# Altium project soldeerstation.PrjPcb
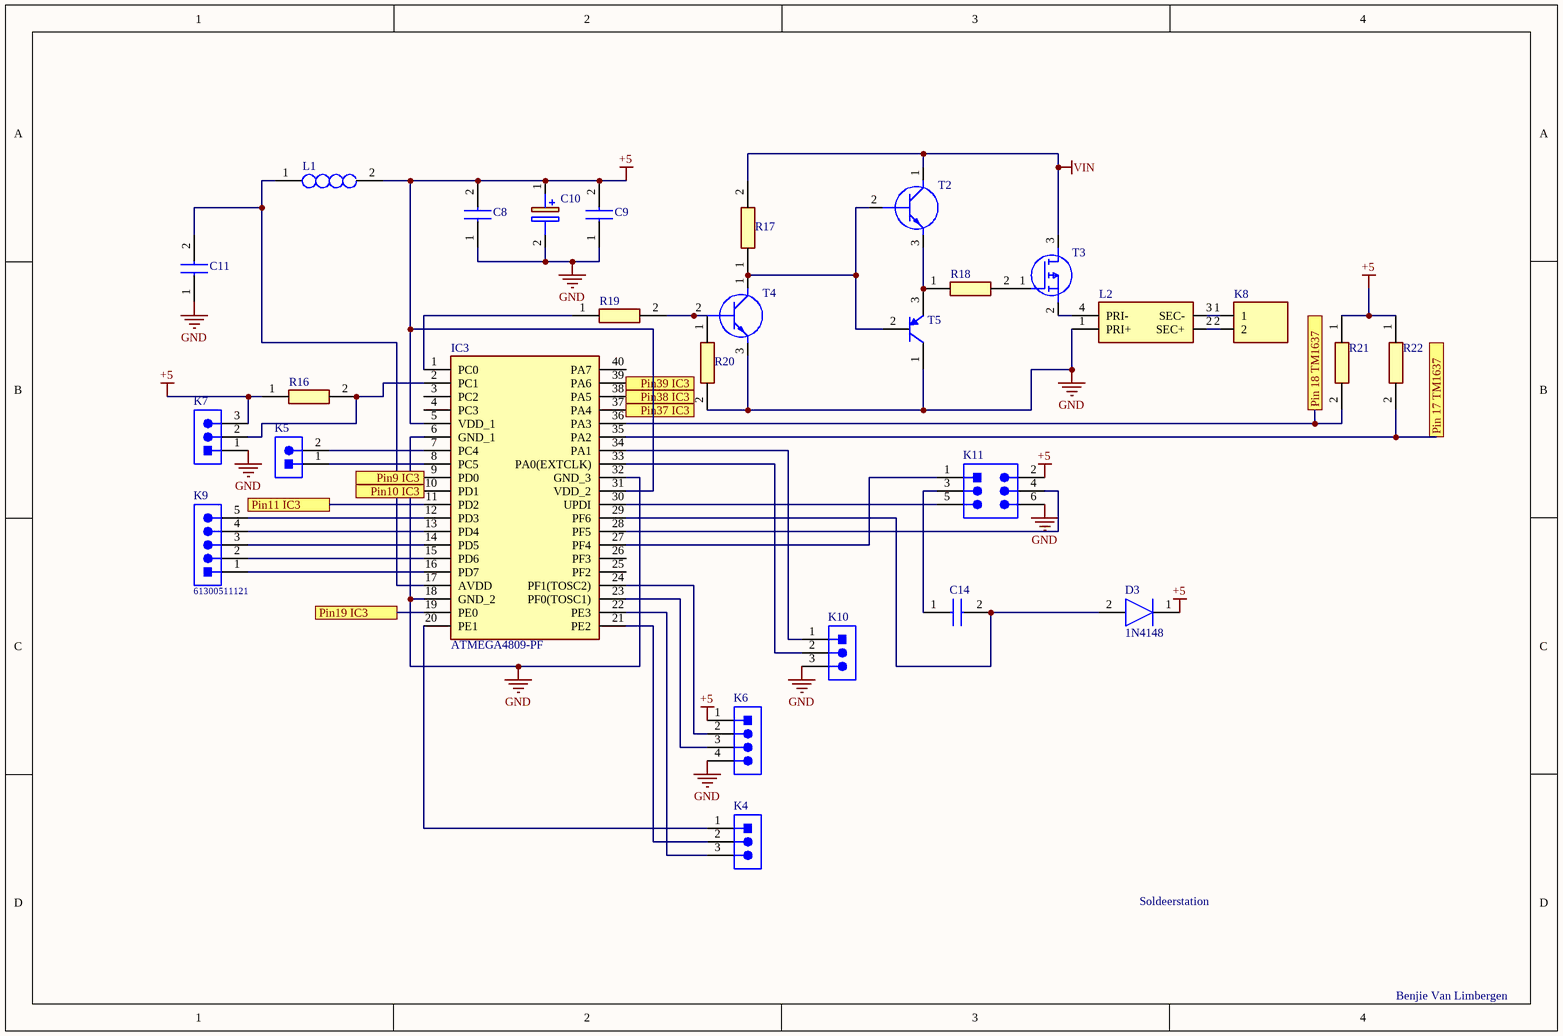
[diagram p0: main.SchDoc]
Title: Soldeerstation
4 sheets, 74 parts. Net scope: flat (ports and power ports of the same name join across sheets).
Board file: PCBv4.PcbDoc
Sheets:
  main.SchDoc
  display.SchDoc
  opamps.SchDoc
  voeding.SchDoc

## Sheet main.SchDoc: Soldeerstation
size A4; DrawnBy: Benjie Van Limbergen; SheetNumber: 1; SheetTotal: 4

### Parts
C8  885012207098  [CAPC2012X90N]  (value not drawn)
C9  885012207098  [CAPC2012X90N]  (value not drawn)
C10  860240672002  [CAPPRD200W52D500H1250]  (value not drawn)
C11  885012207098  [CAPC2012X90N]  (value not drawn)
C14  885012207092  [CAPC2012X90N]  (value not drawn)
D3  1N4148  [DIOAD1165W56L425D185]
IC3  ATMEGA4809-PF  [DIP1543W58P254L5175H635Q40N]
K4  61300311121  [HDR1X3]  (value not drawn)
K5  61300211121  [HDR1X2]  (value not drawn)
K6  61000418221  [HDR1X4]  (value not drawn)
K7  61300311121  [HDR1X3]  (value not drawn)
K8  691214110002  [691214110002]  (value not drawn)
K9  61300511121  [HDR1X5]
K10  61300311121  [HDR1X3]  (value not drawn)
K11  61000621121  [HDR2X3]  (value not drawn)
L1  744711003  [744711003]  (value not drawn)
L2  CM2545X171B-10  [CM2545X171B10]  (value not drawn)
R16  C  [RESC2012X60N]  (value not drawn)
R17  smd  [RESC2012X60N]  (value not drawn)
R18  smd  [RESC2012X60N]  (value not drawn)
R19  smd  [RESC2012X60N]  (value not drawn)
R20  smd  [RESC2012X60N]  (value not drawn)
R21  CRCW08051M00JNEAC  [RESC2012X60N]  (value not drawn)
R22  CRCW08051M00JNEAC  [RESC2012X60N]  (value not drawn)
T2  BC547CBU  [BC547CBU]  (value not drawn)
T3  IRF9Z34NPBF  [TO254P469X1042X1967-3P]  (value not drawn)
T4  BC547CBU  [BC547CBU]  (value not drawn)
T5  BC557CG  [ONSC-TO-92-3-29-11]  (value not drawn)

### Ports
Pin9 IC3, Pin10 IC3, Pin11 IC3, Pin19 IC3, Pin37 IC3, Pin38 IC3, Pin39 IC3, Pin 17 TM1637, Pin 18 TM1637

### Nets
+5: C8.2 C9.2 C10.1(+) D3.1(K) IC3.5(VDD_1) IC3.31(VDD_2) K6.1 K7.3 K11.2 L1.2 R16.1 R21.1 R22.1
GND: C8.1 C9.1 C10.2(-) C11.1 IC3.6(GND_1) IC3.18(GND_2) IC3.32(GND_3) K6.4 K7.1 K10.3 K11.6 L2.1(PRI+) R20.2 T4.3(E) T5.1(C)
VIN: R17.2 T2.1(C) T3.3(D)
NetC6_1: IC3.9(PD0) ; port Pin9 IC3
NetC11_2: C11.2 IC3.17(AVDD) L1.1
NetC12_1: IC3.10(PD1) ; port Pin10 IC3
NetC14_1: C14.1 K11.3
NetC14_2: C14.2 D3.2(A) IC3.29(PF6)
NetD2_1: IC3.11(PD2) ; port Pin11 IC3
NetENC_2: IC3.37(PA4) ; port Pin37 IC3
NetENC_3: IC3.38(PA5) ; port Pin38 IC3
NetENC_5: IC3.39(PA6) ; port Pin39 IC3
NetIC3_1: IC3.1(PC0) R19.1
NetIC3_2: IC3.2(PC1) K7.2 R16.2
NetIC3_7: IC3.7(PC4) K5.2
NetIC3_8: IC3.8(PC5) K5.1
NetIC3_12: IC3.12(PD3) K9.5
NetIC3_13: IC3.13(PD4) K9.4
NetIC3_14: IC3.14(PD5) K9.3
NetIC3_15: IC3.15(PD6) K9.2
NetIC3_16: IC3.16(PD7) K9.1
NetIC3_19: IC3.19(PE0) ; port Pin19 IC3
NetIC3_20: IC3.20(PE1) K4.1
NetIC3_21: IC3.21(PE2) K4.2
NetIC3_22: IC3.22(PE3) K4.3
NetIC3_23: IC3.23(PF0(TOSC1)) K6.3
NetIC3_24: IC3.24(PF1(TOSC2)) K6.2
NetIC3_27: IC3.27(PF4) K11.1
NetIC3_28: IC3.28(PF5) K11.4
NetIC3_30: IC3.30(UPDI) K11.5
NetIC3_33: IC3.33(PA0(EXTCLK)) K10.2
NetIC3_34: IC3.34(PA1) K10.1
NetIC3_35: IC3.35(PA2) R22.2 ; port Pin 17 TM1637
NetIC3_36: IC3.36(PA3) R21.2 ; port Pin 18 TM1637
NetK8_1: K8.1 L2.3(SEC-)
NetK8_2: K8.2 L2.2(SEC+)
NetL2_4: L2.4(PRI-) T3.2(S)
NetR17_1: R17.1 T2.2(B) T4.1(C) T5.2(B)
NetR18_1: R18.1 T2.3(E) T5.3(E)
NetR18_2: R18.2 T3.1(G)
NetR19_2: R19.2 R20.1 T4.2(B)

Not connected (* = marked no-connect by the designer): IC3 3(PC2) 4(PC3) 25(PF2) 26(PF3) 40(PA7)

### Library data of the parts
C8 C9 C11 = 885012207098: Capacitor, C3,C8,C9,C11,C14; Manufacturer_Name: Wurth Elektronik; Datasheet Link: https://componentsearchengine.com//885012207098.pdf; Height: 0.9mm; Mouser2 Part Number: 710-885012207098; Mouser2 Price/Stock: https://www.mouser.com/Search/Refine.aspx?Keyword=710-885012207098; Manufacturer_Part_Number: 885012207098
C10 = 860240672002: Capacitor Polarised c10; Manufacturer_Name: Wurth Elektronik; Datasheet Link: https://katalog.we-online.de/pbs/datasheet/860240672002.pdf; Height: 12.5mm; Manufacturer_Part_Number: 860240672002
C14 = 885012207092: Capacitor c14 100n; Manufacturer_Name: Wurth Elektronik; Datasheet Link: https://katalog.we-online.com/pbs/datasheet/885012207092.pdf; Height: 0.9mm; Manufacturer_Part_Number: 885012207092
D3 = 1N4148: Diode D3; Manufacturer_Name: Nexperia; Datasheet Link: https://datasheet.datasheetarchive.com/originals/distributors/Datasheets-112/DSAP0040891.pdf; Manufacturer_Part_Number: 1N4148
IC3 = ATMEGA4809-PF: Integrated Circuit; Manufacturer_Name: Microchip; Datasheet Link: https://componentsearchengine.com//ATMEGA4809-PF.pdf; Height: 6.35mm; Mouser2 Part Number: 556-ATMEGA4809-PF; Mouser2 Price/Stock: https://www.mouser.com/Search/Refine.aspx?Keyword=556-ATMEGA4809-PF; Manufacturer_Part_Number: ATMEGA4809-PF
K4 K7 = 61300311121: WR-PHD Pin Header, THT, pitch 2.54mm, Single Row, Vertical, 3p; Manufacturer: Wurth Elektronik; Pin Number: 3; Rated Current: 3A; Working Voltage: 250VAC; Withstanding Voltage: 500VAC; Contact Resistance: 20mOhm; ComponentLink1Description: Manufacturer; ComponentLink1URL: http://www.we-online.de; ComponentLink2Description: Datasheet; ComponentLink2URL: https://www.we-online.com/catalog/datasheet/61300311121.pdf; Manufacturer Part Number: 61300311121; Pitch: 2.54mm; Operating Temperature: -40 to +105degC; Mounting Technology: THT; Packaging: Bag; Gender: Pin Header; Row Number: Single; Orientation: Vertical
K5 = 61300211121: WR-PHD Pin Header, THT, pitch 2.54mm, Single Row, Vertical, 2p; Manufacturer: Wurth Elektronik; Pin Number: 2; Rated Current: 3A; Working Voltage: 250VAC; Withstanding Voltage: 500VAC; Contact Resistance: 20mOhm; ComponentLink1Description: Manufacturer; ComponentLink1URL: http://www.we-online.de; ComponentLink2Description: Datasheet; ComponentLink2URL: https://www.we-online.com/catalog/datasheet/61300211121.pdf; Manufacturer Part Number: 61300211121; Pitch: 2.54mm; Operating Temperature: -40 to +105degC; Mounting Technology: THT; Packaging: Bag; Gender: Pin Header; Row Number: Single; Orientation: Vertical
K6 = 61000418221: 4p Header K6; Manufacturer: Wurth Elektronik; Pin Number: 4; Pitch: 2.54mm; Gender: Pin Header; Rated Current: 3A; Working Voltage: 250VAC; Withstanding Voltage: 500VAC; Contact Resistance: 20mOhm; Row Number: Single; ComponentLink1Description: Manufacturer; ComponentLink1URL: http://www.we-online.de; ComponentLink2Description: Datasheet; ComponentLink2URL: https://www.we-online.com/catalog/datasheet/61000418221.pdf; Manufacturer Part Number: 61000418221; Operating Temperature: -40 to +125degC; Mounting Technology: SMT; Packaging: Tube; Orientation: Vertical
K8 = 691214110002: Connector; Manufacturer_Name: Wurth Elektronik; Height: 8.7mm; Manufacturer_Part_Number: 691214110002
K9 = 61300511121: 5P Header k9; Manufacturer: Wurth Elektronik; Pin Number: 5; Pitch: 2.54mm; Gender: Pin Header; Rated Current: 3A; Working Voltage: 250VAC; Withstanding Voltage: 500VAC; Contact Resistance: 20mOhm; Row Number: Single; ComponentLink1Description: Manufacturer; ComponentLink1URL: http://www.we-online.de; ComponentLink2Description: Datasheet; ComponentLink2URL: https://www.we-online.com/catalog/datasheet/61300511121.pdf; Manufacturer Part Number: 61300511121; Operating Temperature: -40 to +105degC; Mounting Technology: THT; Packaging: Bag; Orientation: Vertical
K10 = 61300311121: 3p header K10; Manufacturer: Wurth Elektronik; Pin Number: 3; Pitch: 2.54mm; Gender: Pin Header; Rated Current: 3A; Working Voltage: 250VAC; Withstanding Voltage: 500VAC; Contact Resistance: 20mOhm; Row Number: Single; ComponentLink1Description: Manufacturer; ComponentLink1URL: http://www.we-online.de; ComponentLink2Description: Datasheet; ComponentLink2URL: https://www.we-online.com/catalog/datasheet/61300311121.pdf; Manufacturer Part Number: 61300311121; Operating Temperature: -40 to +105degC; Mounting Technology: THT; Packaging: Bag; Orientation: Vertical
K11 = 61000621121: WR-PHD Pin Header, SMT, pitch 2.54mm, Dual Row, Vertical, 6p; Manufacturer: Wurth Elektronik; Pin Number: 6; Rated Current: 3A; Working Voltage: 250VAC; Withstanding Voltage: 500VAC; Contact Resistance: 20mOhm; ComponentLink1Description: Manufacturer; ComponentLink1URL: http://www.we-online.de; ComponentLink2Description: Datasheet; ComponentLink2URL: https://www.we-online.com/catalog/datasheet/61000621121.pdf; Manufacturer Part Number: 61000621121; Pitch: 2.54mm; Operating Temperature: -40 to +125degC; Mounting Technology: SMT; Packaging: Tube; Gender: Pin Header; Row Number: Dual; Orientation: Vertical
L1 = 744711003: Inductor, Smoorspoel 10uH; Manufacturer_Name: Wurth Elektronik; Datasheet Link: https://www.we-online.de/katalog/datasheet/744711003.pdf; Height: 6.2mm; Manufacturer_Part_Number: 744711003
L2 = CM2545X171B-10: Transformer; Manufacturer_Name: Laird Technologies; Datasheet Link: https://datasheet.datasheetarchive.com/originals/dk/DKDS-7/122753.pdf; Height: 9.5mm; Manufacturer_Part_Number: CM2545X171B-10
R16 R20 = CRCW08051M00JNEAC: Resistor R1-22 / 4k7; Manufacturer_Name: Vishay; Datasheet Link: https://componentsearchengine.com//CRCW08051M00JNEAC.pdf; Height: 0.6mm; Mouser2 Part Number: 71-CRCW08051M00JNEAC; Mouser2 Price/Stock: https://www.mouser.com/Search/Refine.aspx?Keyword=71-CRCW08051M00JNEAC; Manufacturer_Part_Number: CRCW08051M00JNEAC
R17 = CRCW08051M00JNEAC: 4k7; Manufacturer_Name: Vishay; Datasheet Link: https://componentsearchengine.com//CRCW08051M00JNEAC.pdf; Height: 0.6mm; Mouser2 Part Number: 71-CRCW08051M00JNEAC; Mouser2 Price/Stock: https://www.mouser.com/Search/Refine.aspx?Keyword=71-CRCW08051M00JNEAC; Manufacturer_Part_Number: CRCW08051M00JNEAC
R18 = CRCW08051M00JNEAC: 100k; Manufacturer_Name: Vishay; Datasheet Link: https://componentsearchengine.com//CRCW08051M00JNEAC.pdf; Height: 0.6mm; Mouser2 Part Number: 71-CRCW08051M00JNEAC; Mouser2 Price/Stock: https://www.mouser.com/Search/Refine.aspx?Keyword=71-CRCW08051M00JNEAC; Manufacturer_Part_Number: CRCW08051M00JNEAC
R19 = CRCW08051M00JNEAC: 10k; Manufacturer_Name: Vishay; Datasheet Link: https://componentsearchengine.com//CRCW08051M00JNEAC.pdf; Height: 0.6mm; Mouser2 Part Number: 71-CRCW08051M00JNEAC; Mouser2 Price/Stock: https://www.mouser.com/Search/Refine.aspx?Keyword=71-CRCW08051M00JNEAC; Manufacturer_Part_Number: CRCW08051M00JNEAC
R21 R22 = CRCW08051M00JNEAC: Resistor R1-22; Manufacturer_Name: Vishay; Datasheet Link: https://componentsearchengine.com//CRCW08051M00JNEAC.pdf; Height: 0.6mm; Mouser2 Part Number: 71-CRCW08051M00JNEAC; Mouser2 Price/Stock: https://www.mouser.com/Search/Refine.aspx?Keyword=71-CRCW08051M00JNEAC; Manufacturer_Part_Number: CRCW08051M00JNEAC
T2 T4 = BC547CBU: Transistor BJT NPN; Manufacturer_Name: ON Semiconductor; Datasheet Link: https://www.onsemi.com/pdf/datasheet/bc550-d.pdf; Height: 5.33mm; Manufacturer_Part_Number: BC547CBU
T3 = IRF9Z34NPBF: MOSFET (P-Channel); Manufacturer_Name: Infineon; Datasheet Link: https://componentsearchengine.com//IRF9Z34NPBF.pdf; Height: 4.69mm; Mouser2 Part Number: 942-IRF9Z34NPBF; Mouser2 Price/Stock: https://www.mouser.com/Search/Refine.aspx?Keyword=942-IRF9Z34NPBF; Manufacturer_Part_Number: IRF9Z34NPBF
T5 = CMP-1048-01441-1: Amplifier Transistor, PNP Silicon, 3-Pin TO-92, Pb-Free, Bulk Box; Manufacturer: On Semiconductor; IC Continuous (A): -0.1; RoHS: TRUE; DatasheetVersion: Rev. 3; ComponentLink2Description: Datasheet; Packing: Bulk Box; PackageReference: TO-92-3-29-11_AM_SL; ComponentLink3URL: http://www.onsemi.cn/pub_link/Collateral/2N6426-D.PDF; ComponentLink2URL: http://www.onsemi.com/pub_link/Collateral/BC556B-D.PDF; PartNumber: BC557CG; PackageDescription: 3-Pin Transistor Outline, Body 4.825 x 3.685 mm, Pitch 1.27 mm; PackageVersion: Rev. AM; ComponentLink3Description: Package Specification; ComponentLink1URL: http://www.onsemi.com/; ComponentLink1Description: Manufacturer URL; Polarity: PNP; Mounting Technology: Through Hole

## Sheet display.SchDoc: Soldeerstation
size A4; DrawnBy: Benjie Van Limbergen; Revision: 1.0; SheetNumber: 2; SheetTotal: 4
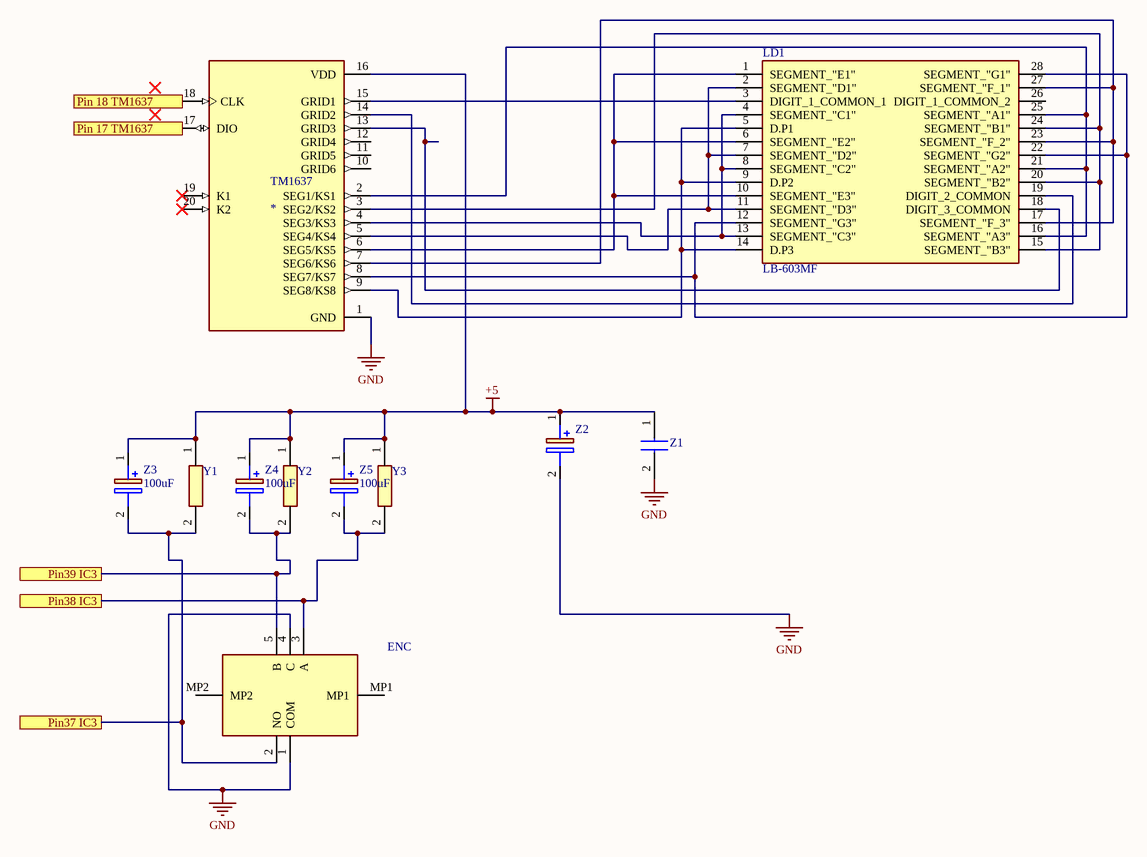
[diagram p1: display.SchDoc]

### Parts
ENC  482016514001  [482016514001]  (value not drawn)
LD1  LB-603MF  [DIP1524W50P254L3750H820Q28N]
TM1637  *  [DIP778W43P254L2612H431Q20N]
Y1  ESR10EZPJ183  [RESC2012X60N]  (value not drawn)
Y2  ESR10EZPJ183  [RESC2012X60N]  (value not drawn)
Y3  ESR10EZPJ183  [RESC2012X60N]  (value not drawn)
Z1  860010683032  [CAPPRD200W55D500H1200]  (value not drawn)
Z2  860240672002  [CAPC2012X90N]  (value not drawn)
Z3  100uF  [CAPC2012X90N]
Z4  100uF  [CAPC2012X90N]
Z5  100uF  [CAPC2012X90N]

### Ports
Pin37 IC3, Pin38 IC3, Pin39 IC3, Pin 17 TM1637, Pin 18 TM1637

### Nets
+5: TM1637.16(VDD) Y1.1 Y2.1 Y3.1 Z1.1(+) Z2.1(+) Z3.1(+) Z4.1(+) Z5.1(+)
GND: ENC.1(COM) ENC.4(C) TM1637.1(GND) Z1.2(-) Z2.2(-)
NetENC_2: ENC.2(NO) Y1.2 Z3.2(-) ; port Pin37 IC3
NetENC_3: ENC.3(A) Y3.2 Z5.2(-) ; port Pin38 IC3
NetENC_5: ENC.5(B) Y2.2 Z4.2(-) ; port Pin39 IC3
NetIC3_35: TM1637.17(DIO) ; port Pin 17 TM1637
NetIC3_36: TM1637.18(CLK) ; port Pin 18 TM1637
NetLD1_1: LD1.1(SEGMENT_"E1") LD1.6(SEGMENT_"E2") LD1.10(SEGMENT_"E3") TM1637.6(SEG5/KS5)
NetLD1_2: LD1.2(SEGMENT_"D1") LD1.7(SEGMENT_"D2") LD1.11(SEGMENT_"D3") TM1637.5(SEG4/KS4)
NetLD1_3: LD1.3(DIGIT_1_COMMON_1) TM1637.15(GRID1)
NetLD1_4: LD1.4(SEGMENT_"C1") LD1.8(SEGMENT_"C2") LD1.13(SEGMENT_"C3") TM1637.4(SEG3/KS3)
NetLD1_5: LD1.5(D.P1) LD1.9(D.P2) LD1.14(D.P3) TM1637.9(SEG8/KS8)
NetLD1_12: LD1.12(SEGMENT_"G3") LD1.22(SEGMENT_"G2") LD1.28(SEGMENT_"G1") TM1637.8(SEG7/KS7)
NetLD1_15: LD1.15(SEGMENT_"B3") LD1.20(SEGMENT_"B2") LD1.24(SEGMENT_"B1") TM1637.3(SEG2/KS2)
NetLD1_16: LD1.16(SEGMENT_"A3") LD1.21(SEGMENT_"A2") LD1.25(SEGMENT_"A1") TM1637.2(SEG1/KS1)
NetLD1_17: LD1.17(SEGMENT_"F_3") LD1.23(SEGMENT_"F_2") LD1.27(SEGMENT_"F_1") TM1637.7(SEG6/KS6)
NetLD1_18: LD1.18(DIGIT_3_COMMON) TM1637.13(GRID3)
NetLD1_19: LD1.19(DIGIT_2_COMMON) TM1637.14(GRID2)

Not connected (* = marked no-connect by the designer): ENC MP1 MP2; LD1 26(DIGIT_1_COMMON_2); TM1637 10(GRID6) 11(GRID5) 12(GRID4) 19(K1)* 20(K2)*

### Library data of the parts
ENC = 482016514001: Switch; Manufacturer_Name: Wurth Elektronik; Datasheet Link: https://componentsearchengine.com//482016514001.pdf; Height: 26.9mm; Mouser2 Part Number: 710-482016514001; Mouser2 Price/Stock: https://www.mouser.com/Search/Refine.aspx?Keyword=710-482016514001; Manufacturer_Part_Number: 482016514001
LD1 = LB-603MF: Display; Manufacturer_Name: ROHM Semiconductor; Datasheet Link: https://datasheet.datasheetarchive.com/originals/distributors/Datasheets_SAMA/27b839e3b28040d1ff79b0bfb62b7eff.pdf; Height: 8.2mm; Manufacturer_Part_Number: LB-603MF
TM1637 = TM1637: LED Drive Control Special Circuit; MF: Titan Micro Electronics; Package: Package; Availability: Not in stock; SnapEDA_Link: https://www.snapeda.com/parts/TM1637/Titan+Micro+Electronics/view-part/?ref=snap; MP: TM1637; Check_prices: https://www.snapeda.com/parts/TM1637/Titan+Micro+Electronics/view-part/?ref=eda; Value: *; Price: None
Y1-Y3 = ESR10EZPJ183: Resistor SMD 0805 10k; Manufacturer_Name: ROHM Semiconductor; Datasheet Link: https://datasheet.datasheetarchive.com/originals/distributors/Datasheets_SAMA/30ccb516c688c96e56c83a00b77a93f4.pdf; Height: 0.65mm; Manufacturer_Part_Number: ESR10EZPJ183
Z1 = 860010683032: Capacitor C1; Manufacturer_Name: Wurth Elektronik; Datasheet Link: https://componentsearchengine.com/Datasheets/2/860010683032.pdf; Height: 41mm; Manufacturer_Part_Number: 860010683032
Z2 = 860240672002: Capacitor Polarised; Manufacturer_Name: Wurth Elektronik; Datasheet Link: https://katalog.we-online.de/pbs/datasheet/860240672002.pdf; Height: 12.5mm; Manufacturer_Part_Number: 860240672002
Z3-Z5 = ECA-1HHG2R2B: Capacitor Polarised C4 3,5mm 8x11mm; Manufacturer_Name: Panasonic; Datasheet Link: http://industrial.panasonic.com/cdbs/www-data/pdf/RDF0000/ABA0000C1215.pdf; Height: 12mm; Manufacturer_Part_Number: ECA-1HHG2R2B

## Sheet opamps.SchDoc: Soldeerstation
size A4; Author: Benjie Van Limbergen; DrawnBy: Benjie Van Limbergen; SheetNumber: 3; SheetTotal: 4
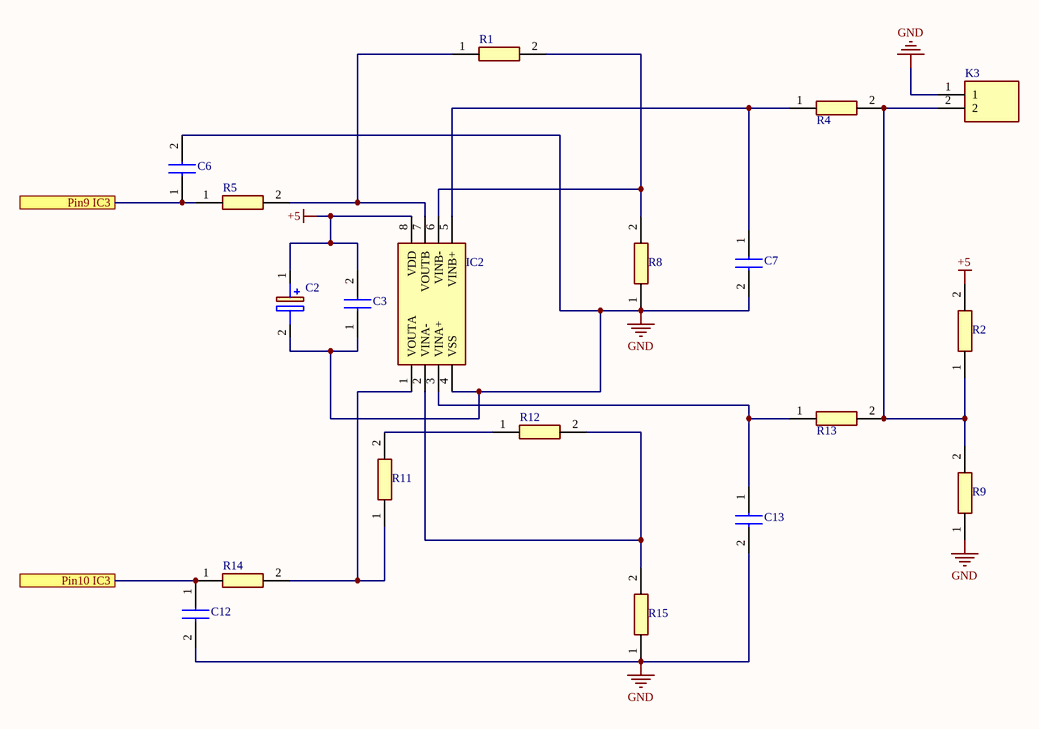
[diagram p2: opamps.SchDoc]

### Parts
C2  860240672002  [CAPPRD200W52D500H1250]  (value not drawn)
C3  885012207098  [CAPC2012X90N]  (value not drawn)
C6  885012205067  [CAPC2012X90N]  (value not drawn)
C7  885012205067  [CAPC2012X90N]  (value not drawn)
C12  885012205067  [CAPC2012X90N]  (value not drawn)
C13  885012205067  [CAPC2012X90N]  (value not drawn)
IC2  MCP6002-E_P  [DIP781W56P254L950H533Q8N]  (value not drawn)
K3  691214110002  [691214110002]  (value not drawn)
R1  smd  [RESC2012X60N]  (value not drawn)
R2  smd  [RESC2012X60N]  (value not drawn)
R4  smd  [RESC2012X60N]  (value not drawn)
R5  smd  [RESC2012X60N]  (value not drawn)
R8  smd  [RESC2012X60N]  (value not drawn)
R9  smd  [RESC2012X60N]  (value not drawn)
R11  smd  [RESC2012X60N]  (value not drawn)
R12  smd  [RESC2012X60N]  (value not drawn)
R13  smd  [RESC2012X60N]  (value not drawn)
R14  smd  [RESC2012X60N]  (value not drawn)
R15  smd  [RESC2012X60N]  (value not drawn)

### Ports
Pin9 IC3, Pin10 IC3

### Nets
+5: C2.1(+) C3.2 IC2.8(VDD) R2.2
GND: C2.2(-) C3.1 C6.2 C7.2 C12.2 C13.2 IC2.4(VSS) K3.1 R8.1 R9.1 R15.1
NetC6_1: C6.1 R5.1 ; port Pin9 IC3
NetC7_1: C7.1 IC2.5(VINB+) R4.1
NetC12_1: C12.1 R14.1 ; port Pin10 IC3
NetC13_1: C13.1 IC2.3(VINA+) R13.1
NetIC2_1: IC2.1(VOUTA) R11.1 R14.2
NetIC2_2: IC2.2(VINA-) R12.2 R15.2
NetIC2_6: IC2.6(VINB-) R1.2 R8.2
NetIC2_7: IC2.7(VOUTB) R1.1 R5.2
NetK3_2: K3.2 R2.1 R4.2 R9.2 R13.2
NetR11_2: R11.2 R12.1

### Library data of the parts
C2 = 860240672002: Capacitor Polarised 10uf 50v stee 2mm 5x11mm; Manufacturer_Name: Wurth Elektronik; Datasheet Link: https://katalog.we-online.de/pbs/datasheet/860240672002.pdf; Height: 12.5mm; Manufacturer_Part_Number: 860240672002
C3 = 885012207098: Capacitor, C3,C8,C9,C11,C14 100nf; Manufacturer_Name: Wurth Elektronik; Datasheet Link: https://componentsearchengine.com//885012207098.pdf; Height: 0.9mm; Mouser2 Part Number: 710-885012207098; Mouser2 Price/Stock: https://www.mouser.com/Search/Refine.aspx?Keyword=710-885012207098; Manufacturer_Part_Number: 885012207098
C6 C7 C12 C13 = 885012205067: Capacitor C6, C7, C12,C13; Manufacturer_Name: Wurth Elektronik; Datasheet Link: https://katalog.we-online.com/pbs/datasheet/885012205067.pdf; Height: 0.55mm; Manufacturer_Part_Number: 885012205067
IC2 = MCP6002-E_P: IC Dual Opamp; Manufacturer_Name: Microchip; Manufacturer_Part_Number: MCP6002-E/P; Datasheet Link: https://componentsearchengine.com//MCP6002-E_P.pdf; Height: 5.334mm; Mouser2 Part Number: 579-MCP6002-E/P; Mouser2 Price/Stock: https://www.mouser.com/Search/Refine.aspx?Keyword=579-MCP6002-E%2FP
K3 = 691214110002: Connector K3; Manufacturer_Name: Wurth Elektronik; Height: 8.7mm; Manufacturer_Part_Number: 691214110002
R1 R4 R5 R8 = CRCW08051M00JNEAC: 100k; Manufacturer_Name: Vishay; Datasheet Link: https://componentsearchengine.com//CRCW08051M00JNEAC.pdf; Height: 0.6mm; Mouser2 Part Number: 71-CRCW08051M00JNEAC; Mouser2 Price/Stock: https://www.mouser.com/Search/Refine.aspx?Keyword=71-CRCW08051M00JNEAC; Manufacturer_Part_Number: CRCW08051M00JNEAC
R2 = CRCW08051M00JNEAC: 1m; Manufacturer_Name: Vishay; Datasheet Link: https://componentsearchengine.com//CRCW08051M00JNEAC.pdf; Height: 0.6mm; Mouser2 Part Number: 71-CRCW08051M00JNEAC; Mouser2 Price/Stock: https://www.mouser.com/Search/Refine.aspx?Keyword=71-CRCW08051M00JNEAC; Manufacturer_Part_Number: CRCW08051M00JNEAC
R9 = CRCW08051M00JNEAC: 10m; Manufacturer_Name: Vishay; Datasheet Link: https://componentsearchengine.com//CRCW08051M00JNEAC.pdf; Height: 0.6mm; Mouser2 Part Number: 71-CRCW08051M00JNEAC; Mouser2 Price/Stock: https://www.mouser.com/Search/Refine.aspx?Keyword=71-CRCW08051M00JNEAC; Manufacturer_Part_Number: CRCW08051M00JNEAC
R11 R12 = CRCW08051M00JNEAC: 18k; Manufacturer_Name: Vishay; Datasheet Link: https://componentsearchengine.com//CRCW08051M00JNEAC.pdf; Height: 0.6mm; Mouser2 Part Number: 71-CRCW08051M00JNEAC; Mouser2 Price/Stock: https://www.mouser.com/Search/Refine.aspx?Keyword=71-CRCW08051M00JNEAC; Manufacturer_Part_Number: CRCW08051M00JNEAC
R13 R14 = CRCW08051M00JNEAC: 5k6; Manufacturer_Name: Vishay; Datasheet Link: https://componentsearchengine.com//CRCW08051M00JNEAC.pdf; Height: 0.6mm; Mouser2 Part Number: 71-CRCW08051M00JNEAC; Mouser2 Price/Stock: https://www.mouser.com/Search/Refine.aspx?Keyword=71-CRCW08051M00JNEAC; Manufacturer_Part_Number: CRCW08051M00JNEAC
R15 = CRCW08051M00JNEAC: 100ohm; Manufacturer_Name: Vishay; Datasheet Link: https://componentsearchengine.com//CRCW08051M00JNEAC.pdf; Height: 0.6mm; Mouser2 Part Number: 71-CRCW08051M00JNEAC; Mouser2 Price/Stock: https://www.mouser.com/Search/Refine.aspx?Keyword=71-CRCW08051M00JNEAC; Manufacturer_Part_Number: CRCW08051M00JNEAC

## Sheet voeding.SchDoc: Voeding
size A4; Date: 18/03/2022; Engineer: Benjie Van Limbergen; Revision: 1.0; SheetNumber: 4; SheetTotal: 4
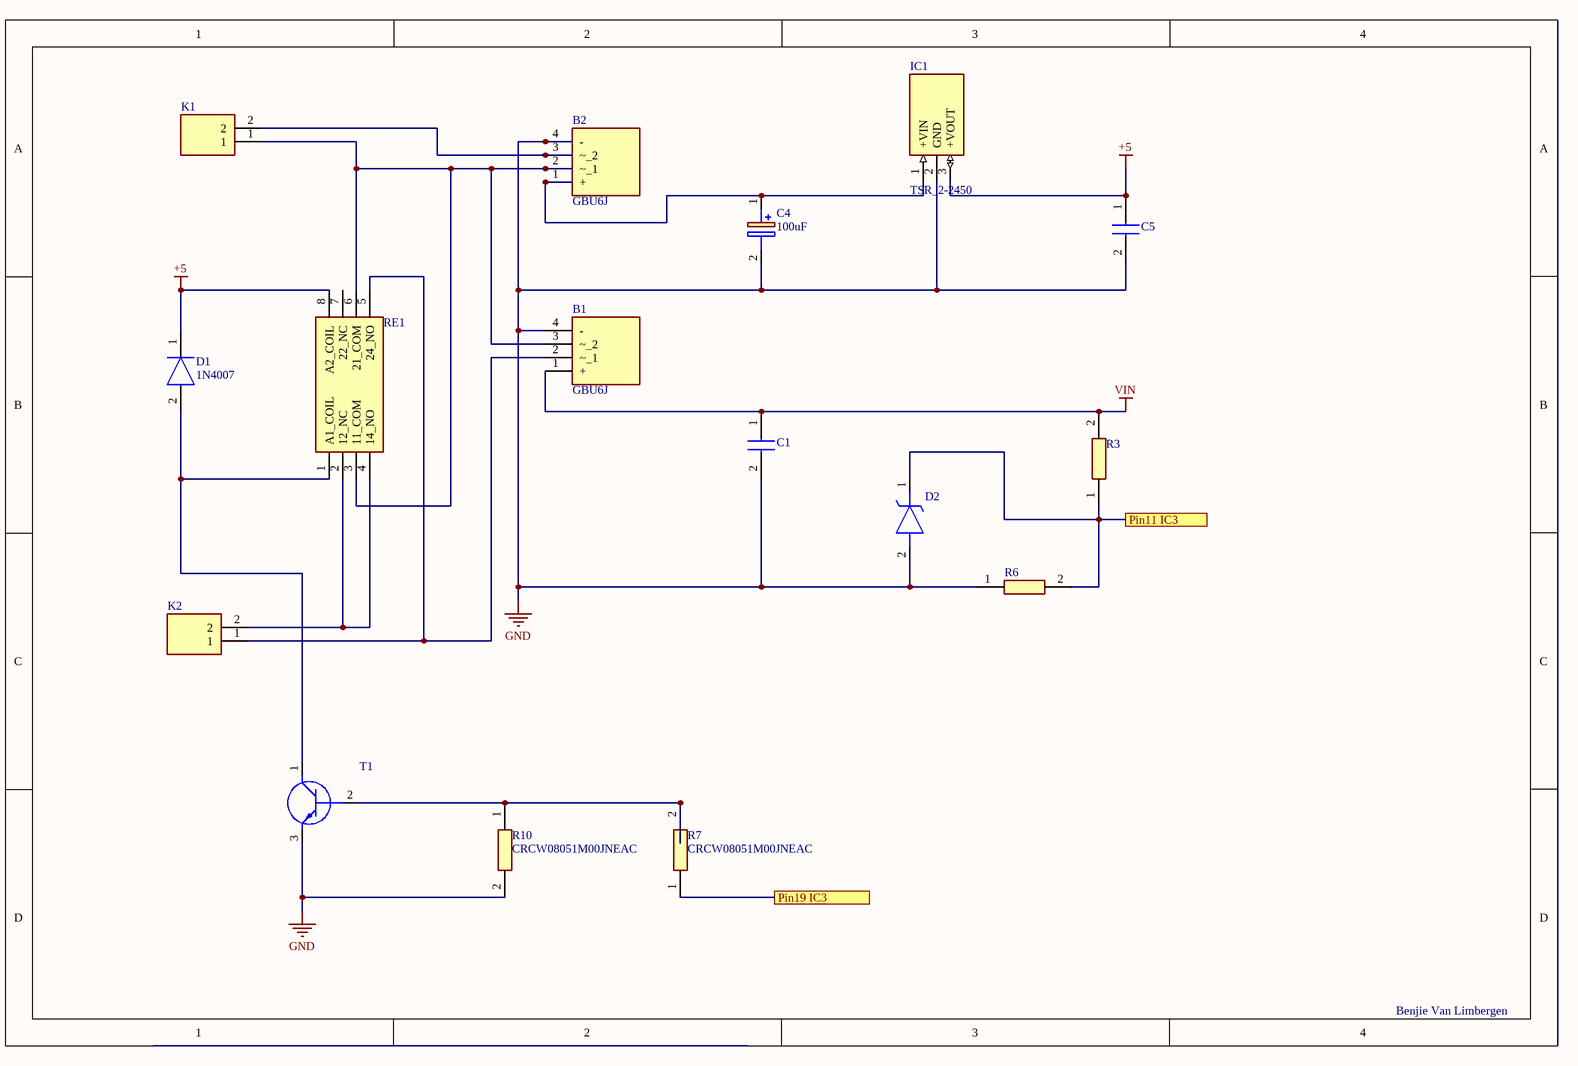
[diagram p3: voeding.SchDoc]

### Parts
B1  GBU6J  [GBU6J]
B2  GBU6J  [GBU6J]
C1  860010683032  [CAPPRD1000W80D2200H4100]  (value not drawn)
C4  100uF  [CAPPRD200W55D500H1200]
C5  860010683032  [CAPPRD200W52D500H1250]  (value not drawn)
D1  1N4007  [DIOAD1410W86L470D235]
D2  1N5231BTR  [DIOAD1068W53L380D172]  (value not drawn)
IC1  TSR_2-2450  [TSR-2]
K1  691214110002  [691214110002]  (value not drawn)
K2  691214110002  [691214110002]  (value not drawn)
R3  CRCW08051M00JNEAC  [RESC2012X60N]  (value not drawn)
R6  CRCW08051M00JNEAC  [RESC2012X60N]  (value not drawn)
R7  CRCW08051M00JNEAC  [RESC2012X60N]
R10  CRCW08051M00JNEAC  [RESC2012X60N]
RE1  RT424005  [RT42]  (value not drawn)
T1  BC547CBU  [BC547CBU]  (value not drawn)

### Ports
Pin11 IC3, Pin19 IC3

### Nets
+5: C5.1(+) D1.1(K) IC1.3(+VOUT) RE1.8(A2_COIL)
GND: B1.4(-) B2.4(-) C1.2(-) C4.2(-) C5.2(-) D2.2(A) IC1.2(GND) R6.1 R10.2 T1.3(E)
VIN: B1.1(+) C1.1(+) R3.2
NetB1_2: B1.2(~_1) K2.1 RE1.5(24_NO)
NetB1_3: B1.3(~_2) B2.2(~_1) K1.1 RE1.3(11_COM) RE1.6(21_COM)
NetB2_1: B2.1(+) C4.1(+) IC1.1(+VIN)
NetB2_3: B2.3(~_2) K1.2
NetD1_2: D1.2(A) RE1.1(A1_COIL) T1.1(C)
NetD2_1: D2.1(K) R3.1 R6.2 ; port Pin11 IC3
NetIC3_19: R7.1 ; port Pin19 IC3
NetK2_2: K2.2 RE1.2(12_NC) RE1.4(14_NO)
NetR7_2: R7.2 R10.1 T1.2(B)

Not connected (* = marked no-connect by the designer): RE1 7(22_NC)

### Notes on the sheet
- Benjie Van Limbergen

### Library data of the parts
B1 B2 = GBU6J: Bridge Rectifier; Manufacturer_Name: GeneSiC Semiconductor; Datasheet Link: https://www.diodemodule.com/silicon_products/bridge_rectifiers/gbu6j.pdf; Height: 18.8mm; Manufacturer_Part_Number: GBU6J
C1 = 860010683032: Capacitor C1 4700u 50v; Manufacturer_Name: Wurth Elektronik; Datasheet Link: https://componentsearchengine.com/Datasheets/2/860010683032.pdf; Height: 41mm; Manufacturer_Part_Number: 860010683032
C4 = ECA-1HHG2R2B: Capacitor Polarised C4; Manufacturer_Name: Panasonic; Datasheet Link: http://industrial.panasonic.com/cdbs/www-data/pdf/RDF0000/ABA0000C1215.pdf; Height: 12mm; Manufacturer_Part_Number: ECA-1HHG2R2B
C5 = 860010683032: Capacitor C5; Manufacturer_Name: Wurth Elektronik; Datasheet Link: https://componentsearchengine.com/Datasheets/2/860010683032.pdf; Height: 41mm; Manufacturer_Part_Number: 860010683032
D1 = 1N4007: Diode D1; Manufacturer_Name: MULTICOMP; Datasheet Link: http://www.farnell.com/datasheets/1505911.pdf?_ga=2.248087493.396773729.1562531485-167411096.1502103357; Manufacturer_Part_Number: 1N4007
D2 = 1N5231BTR: Zener Diode D2; Manufacturer_Name: ON Semiconductor; Datasheet Link: https://componentsearchengine.com/Datasheets/1/1N5231BTR.pdf; Manufacturer_Part_Number: 1N5231BTR
IC1 = TSR_2-2450: Power Supply IC1; Manufacturer_Name: Traco Power; Manufacturer_Part_Number: TSR 2-2450; Datasheet Link: https://componentsearchengine.com//TSR 2-2450.pdf; Mouser2 Part Number: 495-TSR2-2450; Mouser2 Price/Stock: https://www.mouser.com/Search/Refine.aspx?Keyword=495-TSR2-2450
K1 K2 = 691214110002: as K8 on sheet main; Height: 8.7mm; Manufacturer_Part_Number: 691214110002
R3 R6 R7 R10 = CRCW08051M00JNEAC: as R21 on sheet main; Datasheet Link: https://componentsearchengine.com//CRCW08051M00JNEAC.pdf; Height: 0.6mm; Mouser2 Part Number: 71-CRCW08051M00JNEAC; Mouser2 Price/Stock: https://www.mouser.com/Search/Refine.aspx?Keyword=71-CRCW08051M00JNEAC; Manufacturer_Part_Number: CRCW08051M00JNEAC
RE1 = RT424005: Relay or Contactor; Manufacturer_Name: TE Connectivity; Datasheet Link: https://componentsearchengine.com//RT424005.pdf; Mouser2 Part Number: 655-RT424005; Mouser2 Price/Stock: https://www.mouser.com/Search/Refine.aspx?Keyword=655-RT424005; Manufacturer_Part_Number: RT424005
T1 = BC547CBU: as T2 on sheet main; Datasheet Link: https://www.onsemi.com/pdf/datasheet/bc550-d.pdf; Height: 5.33mm; Manufacturer_Part_Number: BC547CBU

## Nets that join several sheets
+5: main (13 pins), display (9 pins), opamps (C2.1 C3.2 IC2.8 R2.2), voeding (C5.1 D1.1 IC1.3 RE1.8)
GND: main (15 pins), display (5 pins), opamps (11 pins), voeding (10 pins)
VIN: main (R17.2 T2.1 T3.3), voeding (B1.1 C1.1 R3.2)
NetC6_1: main (IC3.9), opamps (C6.1 R5.1)
NetC12_1: main (IC3.10), opamps (C12.1 R14.1)
NetD2_1: main (IC3.11), voeding (D2.1 R3.1 R6.2)
NetENC_2: main (IC3.37), display (ENC.2 Y1.2 Z3.2)
NetENC_3: main (IC3.38), display (ENC.3 Y3.2 Z5.2)
NetENC_5: main (IC3.39), display (ENC.5 Y2.2 Z4.2)
NetIC3_19: main (IC3.19), voeding (R7.1)
NetIC3_35: main (IC3.35 R22.2), display (TM1637.17)
NetIC3_36: main (IC3.36 R21.2), display (TM1637.18)